# Altium schematic sheet USB.SchDoc
size A4
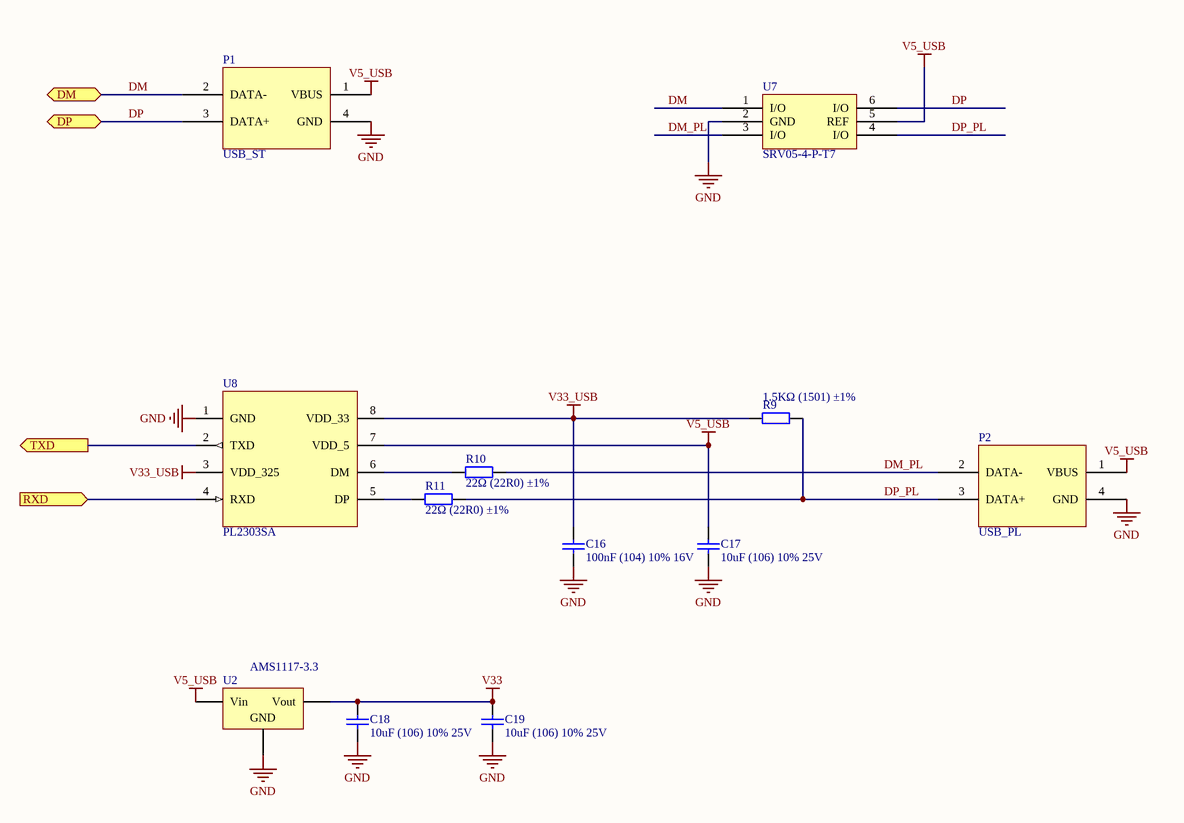
[diagram p0: USB.SchDoc]

## Parts
C16  100nF (104) 10% 16V  [0402_C]
C17  10uF (106) 10% 25V  [0805_C]
C18  10uF (106) 10% 25V  [0805_C]
C19  10uF (106) 10% 25V  [0805_C]
P1  USB_ST  [USB-B/Female]
P2  USB_PL  [USB-B/Female]
R9  1.5KΩ (1501) ±1%  [0402_R]
R10  22Ω (22R0) ±1%  [0402_R]
R11  22Ω (22R0) ±1%  [0402_R]
U2  AMS1117-3.3  [SOT-223]
U7  SRV05-4-P-T7  [SOT-23-6]
U8  PL2303SA  [SOP-8_150mil]

## Ports
DM, DP, RXD (in), TXD (out)

## Nets
GND: C16.1 C17.1 C18.1 C19.1 P1.4(GND) P2.4(GND) U2.1(GND) U7.2(GND) U8.1(GND)
V5_USB: C17.2 P1.1(VBUS) P2.1(VBUS) U2.3(Vin) U7.5(REF) U8.7(VDD_5)
V33: C18.2 C19.2 U2.2(Vout)
V33_USB: C16.2 R9.2 U8.3(VDD_325) U8.8(VDD_33)
DM: P1.2(DATA-) U7.1(I/O) ; port DM
DM_PL: P2.2(DATA-) R10.2 U7.3(I/O)
DP: P1.3(DATA+) U7.6(I/O) ; port DP
DP_PL: P2.3(DATA+) R9.1 R11.2 U7.4(I/O)
RXD: U8.4(RXD) ; port RXD
TXD: U8.2(TXD) ; port TXD
NetR10_1: R10.1 U8.6(DM)
NetR11_1: R11.1 U8.5(DP)

## Library data of the parts
C16 = 0402 100nF (104) 10% 16V: 贴片电容; ComponentLink1Description: 供应商链接; ComponentLink1URL: http://www.szlcsc.com/product/details_1877.html; Package: 0402; Supplier: LC; SuppliersPartNumber: C1525
C17-C19 = 0805 10uF (106) 10% 25V: 贴片电容; ComponentLink1Description: 供应商链接; ComponentLink1URL: http://www.szlcsc.com/product/details_16532.html; Package: 0805; Supplier: LC; SuppliersPartNumber: C15850
P1 P2 = USB-B/Female
R9 = 0402 1.5KΩ (1501) 1%: 贴片电阻; ComponentLink1Description: 供应商链接; ComponentLink1URL: http://www.szlcsc.com/product/details_26610.html; Package: 0402; Supplier: LC; SuppliersPartNumber: C25867
R10 R11 = 0402 22Ω (22R0) 1%: 贴片电阻; ComponentLink1Description: 供应商链接; ComponentLink1URL: http://www.szlcsc.com/product/details_25835.html; Package: 0402; Supplier: LC; SuppliersPartNumber: C25092
U2 = SOT-223 AMS1117-3.3: 低压差线性稳压(LDO); ComponentLink1Description: 供应商链接; ComponentLink1URL: http://www.szlcsc.com/product/details_6652.html; Package: SOT-223; Supplier: LC; SuppliersPartNumber: C6186
U7 = SRV05-4-P-T7_[C85364]: TVS; ComponentLink1Description: 供应商链接; ComponentLink1URL: http://www.szlcsc.com/product/details_86537.html; Package: SOT-23-6; Supplier: LC; SuppliersPartNumber: C85364